# EAGLE design ARE_adaptadora_PIC_18-20pin (EAGLE 6.5.0)
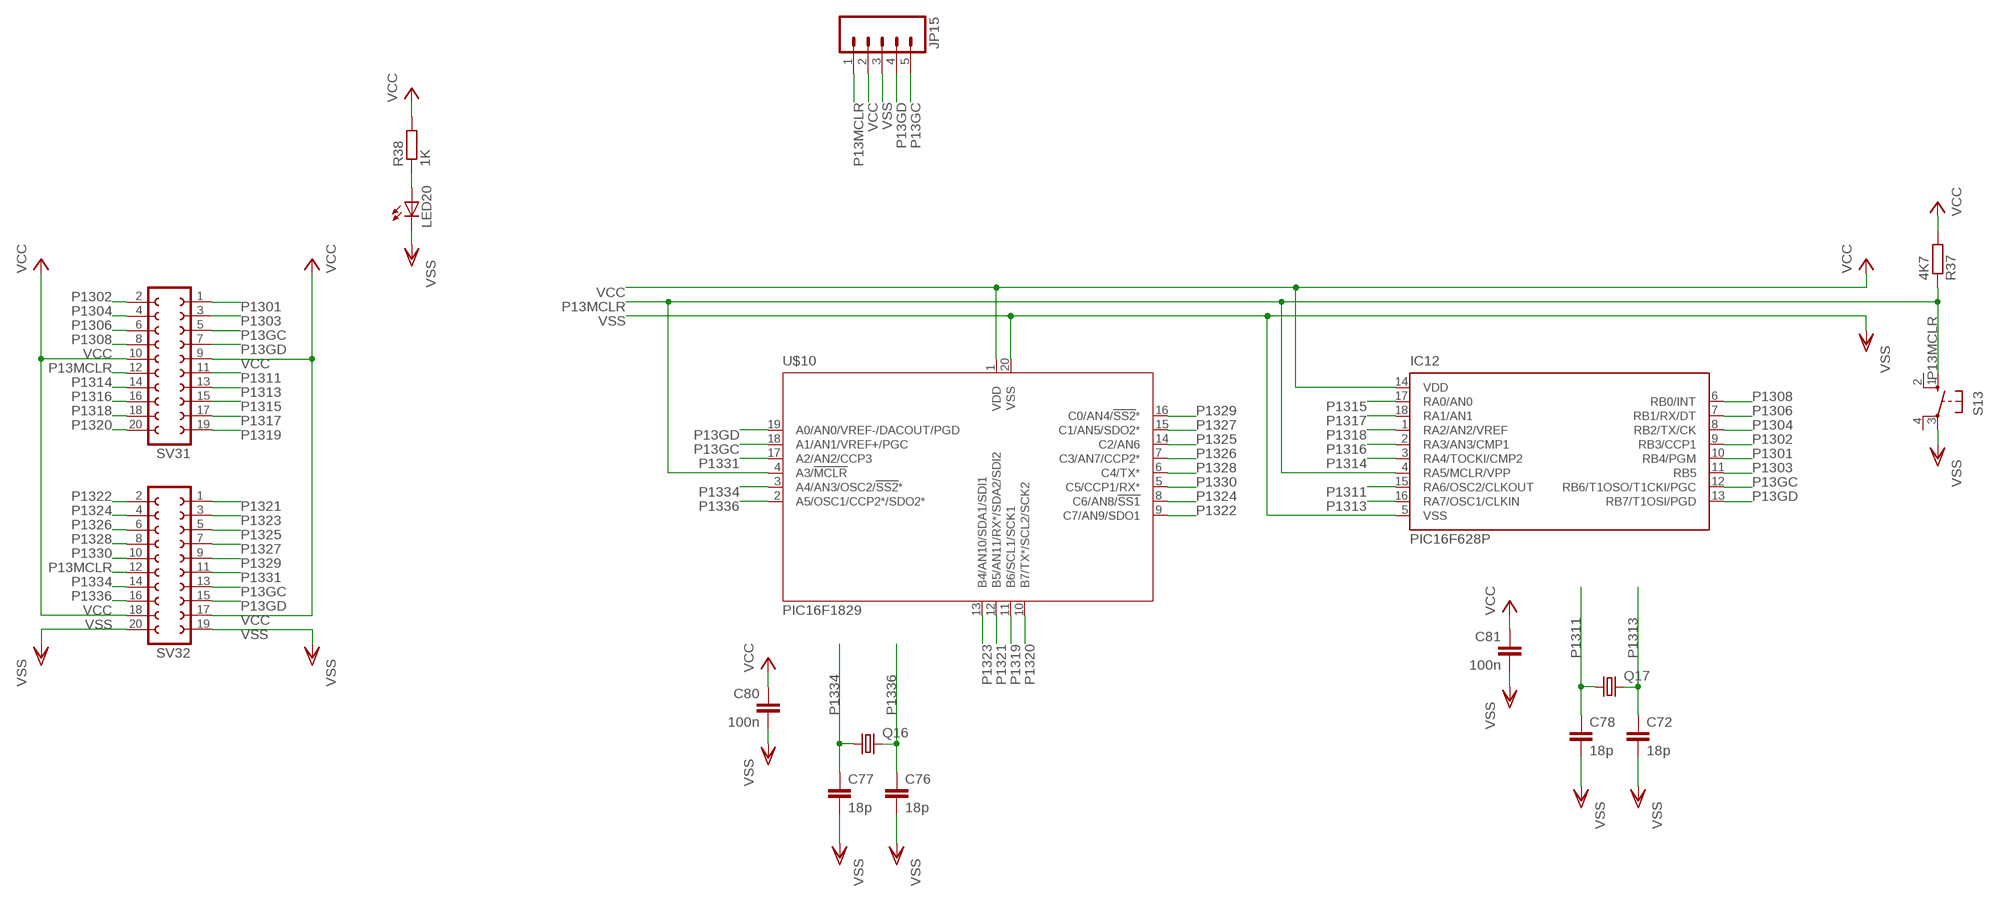
[diagram p0: schematic, sheet 1]

## Parts
C72  18p  C-EUC0805  [C0805]
C76  18p  C-EUC0805  [C0805]
C77  18p  C-EUC0805  [C0805]
C78  18p  C-EUC0805  [C0805]
C80  100n  C-EUC0805  [C0805]
C81  100n  C-EUC0805  [C0805]
IC12  PIC16F628P  [DIL18]
JP15  M05PTH  [1X05]
LED20  LEDCHIPLED_0805  [CHIPLED_0805]
Q16  CRYSTALHC18U-V  [HC18U-V]
Q17  CRYSTALHC18U-V  [HC18U-V]
R37  4K7  R-EU_R0805  [R0805]
R38  1K  R-EU_R0805  [R0805]
S13  10-XX  [B3F-10XX]
SV31  FE10-2W  [FE10-2W]
SV32  FE10-2W  [FE10-2W]
U$10  PIC16F1829  [DIL20]

## Nets
N$81: LED20.A R38.1
P13GC: IC12.12(RB6/T1OSO/T1CKI/PGC) JP15.5 SV31.5 SV32.13 U$10.18(A1/AN1/VREF+/PGC)
P13GD: IC12.13(RB7/T1OSI/PGD) JP15.4 SV31.7 SV32.15 U$10.19(A0/AN0/VREF-/DACOUT/PGD)
P13MCLR: IC12.4(RA5/MCLR/VPP) JP15.1 R37.1 S13.1(S) SV31.12 SV32.12 U$10.4(A3/!MCLR)
P1301: IC12.10(RB4/PGM) SV31.1
P1302: IC12.9(RB3/CCP1) SV31.2
P1303: IC12.11(RB5) SV31.3
P1304: IC12.8(RB2/TX/CK) SV31.4
P1306: IC12.7(RB1/RX/DT) SV31.6
P1308: IC12.6(RB0/INT) SV31.8
P1311: C78.1 IC12.15(RA6/OSC2/CLKOUT) Q17.1 SV31.11
P1313: C72.1 IC12.16(RA7/OSC1/CLKIN) Q17.2 SV31.13
P1314: IC12.3(RA4/TOCKI/CMP2) SV31.14
P1315: IC12.17(RA0/AN0) SV31.15
P1316: IC12.2(RA3/AN3/CMP1) SV31.16
P1317: IC12.18(RA1/AN1) SV31.17
P1318: IC12.1(RA2/AN2/VREF) SV31.18
P1319: SV31.19 U$10.11(B6/SCL1/SCK1)
P1320: SV31.20 U$10.10(B7/TX*/SCL2/SCK2)
P1321: SV32.1 U$10.12(B5/AN11/RX*/SDA2/SDI2)
P1322: SV32.2 U$10.9(C7/AN9/SDO1)
P1323: SV32.3 U$10.13(B4/AN10/SDA1/SDI1)
P1324: SV32.4 U$10.8(C6/AN8/!SS1)
P1325: SV32.5 U$10.14(C2/AN6)
P1326: SV32.6 U$10.7(C3/AN7/CCP2*)
P1327: SV32.7 U$10.15(C1/AN5/SDO2*)
P1328: SV32.8 U$10.6(C4/TX*)
P1329: SV32.9 U$10.16(C0/AN4/!SS2!*)
P1330: SV32.10 U$10.5(C5/CCP1/RX*)
P1331: SV32.11 U$10.17(A2/AN2/CCP3)
P1334: C77.1 Q16.1 SV32.14 U$10.3(A4/AN3/OSC2/!SS2!*)
P1336: C76.1 Q16.2 SV32.16 U$10.2(A5/OSC1/CCP2*/SDO2*)
VCC: C80.1 C81.1 IC12.14(VDD) JP15.2 R37.2 R38.2 SV31.9 SV31.10 SV32.17 SV32.18 U$10.1(VDD)
VSS: C72.2 C76.2 C77.2 C78.2 C80.2 C81.2 IC12.5(VSS) JP15.3 LED20.C S13.3(P) SV32.19 SV32.20 U$10.20(VSS)
Unconnected: S13.2(S1) S13.4(P1)

## Library data of the parts
C72 C76-C78 C80 C81 = rcl:C-EU: CAPACITOR, European symbol
IC12 = microchip:PIC16F62*: FLASH-Based 8-Bit CMOS Microcontroller Source: http://ww1.microchip.com/downloads/en/DeviceDoc/40300C.pdf; MF: MICROCHIP; MPN: PIC16F628-04I/P; OC_FARNELL: 9760407; OC_NEWARK: 19C7272
JP15 = SparkFun:M05: Header 5 Standard 5-pin 0.1" header. Use with straight break away headers (SKU : PRT-00116), right angle break away headers (PRT-00553), swiss pins (PRT-00743), machine pins (PRT-00117), and female headers (PRT-00115). Molex polarized connector foot print use with SKU : PRT-08230 with associated crimp pins and housings.
LED20 = led:LED: LED OSRAM: - CHIPLED LG R971, LG N971, LY N971, LG Q971, LY Q971, LO R971, LY R971 LH N974, LH R974 LS Q976, LO Q976, LY Q976 LO Q996 - Hyper CHIPLED LW Q18S LB Q993, LB Q99A, LB R99A - SideLED LS A670, LO A670, LY A670, LG A670, LP A670 LB A673, LV A673, LT A673, LW A673 LH A674 LY A675 LS A676, LA A676, LO A676, LY A676, LW A676 LS A679, LY A679, LG A679 - Hyper Micro SIDELED® LS Y876, LA Y876, LO Y876, LY Y876 LT Y87S - SmartLED LW L88C, LW L88S LB L89C, LB L89S, LG L890 LS L89K, LO L89K, LY L89K LS L896, LA L896, LO L896, LY L896 - TOPLED LS T670, LO T670, LY T670, LG T670, LP T670 LSG T670, LSP T670, LSY T670, LOP T670, LYG T670 LG T671, LOG T671, LSG T671 LB T673, LV T673, LT T673, LW T673 LH T674 LS T676, LA T676, LO T676, LY T676, LB T676, LH T676, LSB T676, LW T676 LB T67C, LV T67C, LT T67C, LS T67K, LO T67K, LY T67K, LW E67C LS E67B, LA E67B, LO E67B, LY E67B, LB E67C, LV E67C, LT E67C LW T67C LS T679, LY T679, LG T679 LS T770, LO T770, LY T770, LG T770, LP T770 LB T773, LV T773, LT T773, LW T773 LH T774 LS E675, LA E675, LY E675, LS T675 LS T776, LA T776, LO T776, LY T776, LB T776 LHGB T686 LT T68C, LB T68C - Hyper Mini TOPLED® LB M676 - Mini TOPLED Santana® LG M470 LS M47K, LO M47K, LY M47K Source: http://www.osram.convergy.de LUXEON: - LUMILED® LXK2-PW12-R00, LXK2-PW12-S00, LXK2-PW14-U00, LXK2-PW14-V00 LXK2-PM12-R00, LXK2-PM12-S00, LXK2-PM14-U00 LXK2-PE12-Q00, LXK2-PE12-R00, LXK2-PE12-S00, LXK2-PE14-T00, LXK2-PE14-U00 LXK2-PB12-K00, LXK2-PB12-L00, LXK2-PB12-M00, LXK2-PB14-N00, LXK2-PB14-P00, LXK2-PB14-Q00 LXK2-PR12-L00, LXK2-PR12-M00, LXK2-PR14-Q00, LXK2-PR14-R00 LXK2-PD12-Q00, LXK2-PD12-R00, LXK2-PD12-S00 LXK2-PH12-R00, LXK2-PH12-S00 LXK2-PL12-P00, LXK2-PL12-Q00, LXK2-PL12-R00 Source: www.luxeon.com KINGBRIGHT: KA-3528ASYC Source: www.kingbright.com
Q16 Q17 = crystal:CRYSTAL: CRYSTAL; OC_FARNELL: unknown; OC_NEWARK: unknown
R37 R38 = rcl:R-EU_: RESISTOR, European symbol
S13 = switch-omron:10-XX: OMRON SWITCH; MPN: B3F-1000; OC_FARNELL: 176432; OC_NEWARK: 36M3542
SV31 SV32 = con-lsta:FE10-2W: FEMALE HEADER; OC_FARNELL: unknown; OC_NEWARK: unknown
U$10 = microchip:PIC16F1829

## Board
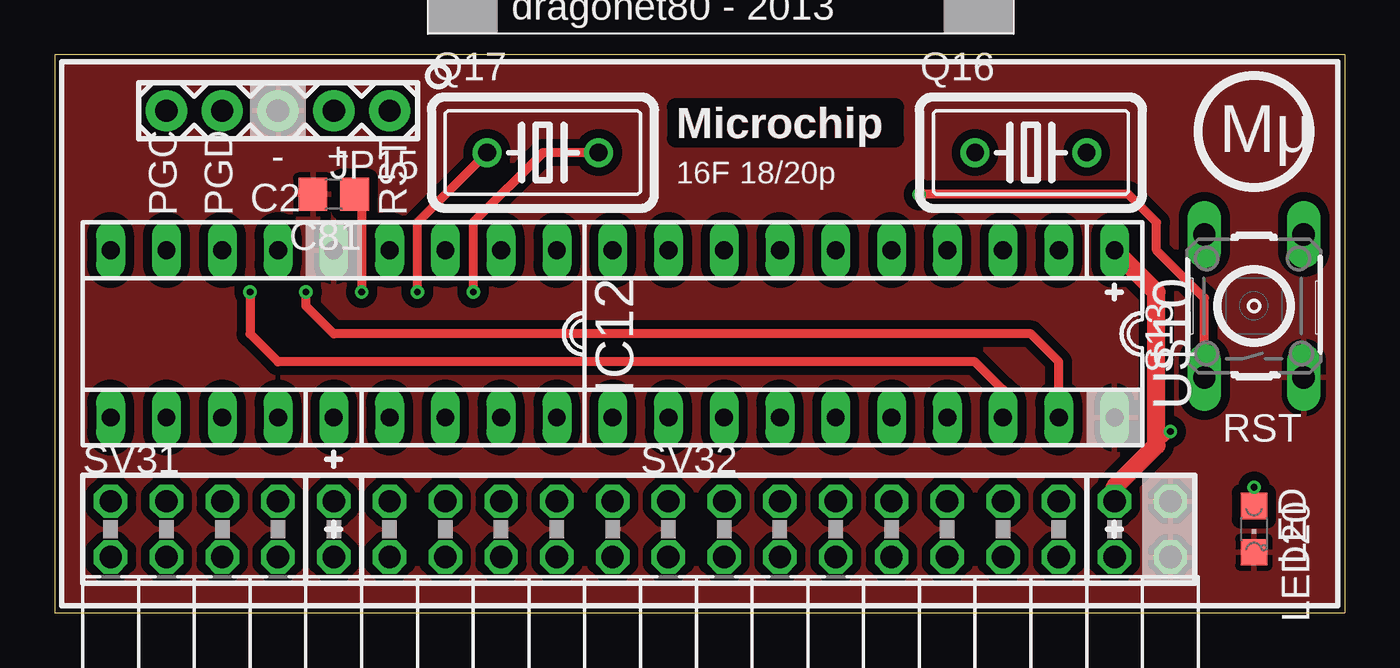
[diagram p1: board, top side]
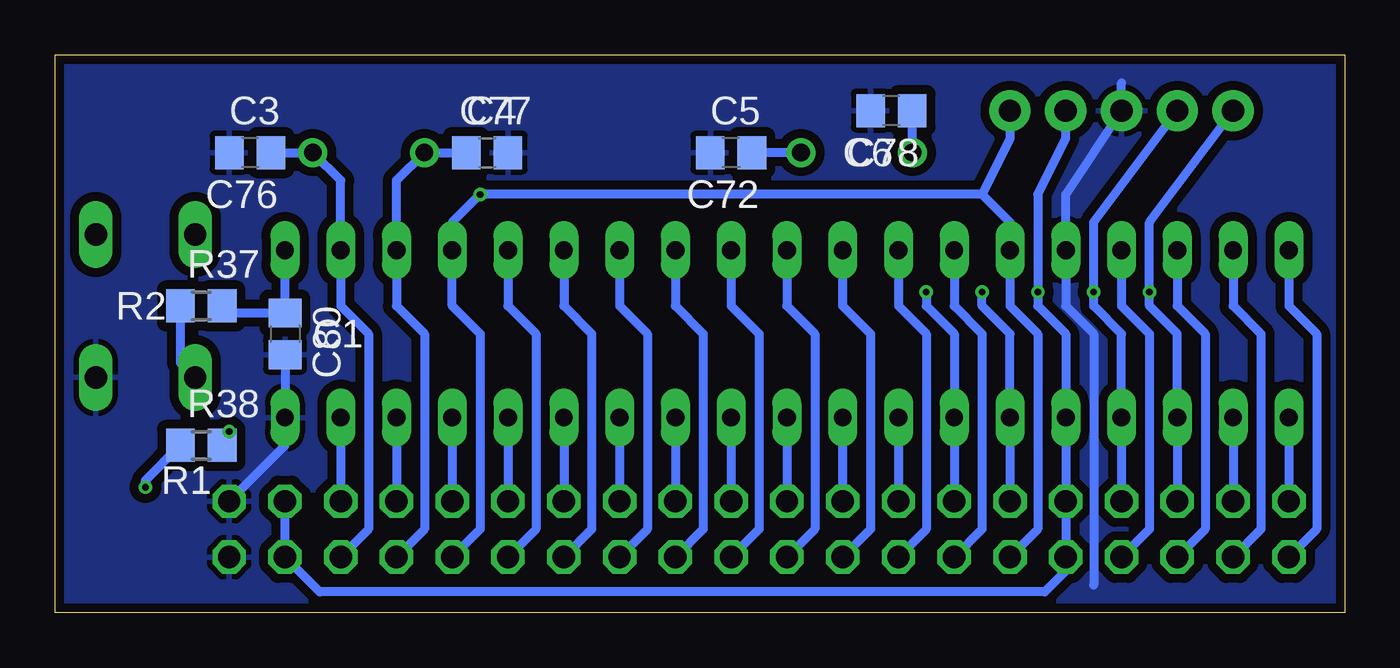
[diagram p2: board, bottom side, seen from below]

Size 58.74 x 25.4 mm. Coordinates in mm from the lower left corner, seen from the top.
Outline: 0,0 58.74,0 58.74,25.4 0,25.4 0,0
Copper layers (1*16): Top 0.035mm / dielectric 1.5mm / Bottom 0.035mm
Design rules "ITEADstudio_DRC": minimum track width 6mil, minimum drill 12mil, track to track 6mil, track to pad 6mil, pad to pad 6mil, via to via 6mil, smd to smd 0mil, copper to edge 10mil, drill to drill 10mil, minimum pad ring 10mil, minimum via ring 6mil, stop-mask expansion 2mil, vias tented up to drill 100mil, thermal gap 10mil

### Footprints (pad centres in the part's own frame; a part is rotated, then mirrored left to right if it is on the bottom)
C0805 = smd 1.3 x 1.5: 1 -0.95,0; 2 0.95,0
DIL18 = drill 0.813 long: 1 -10.16,-3.81; 2 -7.62,-3.81; 3 -5.08,-3.81; 4 -2.54,-3.81; 5 0,-3.81; 6 2.54,-3.81; 7 5.08,-3.81; 8 7.62,-3.81; 9 10.16,-3.81; 10 10.16,3.81; 11 7.62,3.81; 12 5.08,3.81; 13 2.54,3.81; 14 0,3.81; 15 -2.54,3.81; 16 -5.08,3.81; 17 -7.62,3.81; 18 -10.16,3.81
1X05 = drill 1.016 pad 1.88: 1 0,0; 2 2.54,0; 3 5.08,0; 4 7.62,0; 5 10.16,0
CHIPLED_0805 = smd 1.2 x 1.2: A 0,-1.05; C 0,1.05
HC18U-V = drill 0.813: 1 -2.54,0; 2 2.54,0
R0805 = smd 1.3 x 1.5: 1 -0.95,0; 2 0.95,0
B3F-10XX = drill 1.016 long: 1 -3.251,2.261; 2 3.251,2.261; 3 -3.251,-2.261; 4 3.251,-2.261
FE10-2W = drill 1.016 octagon: 1 -11.43,1.27; 2 -11.43,-1.27; 3 -8.89,1.27; 4 -8.89,-1.27; 5 -6.35,1.27; 6 -6.35,-1.27; 7 -3.81,1.27; 8 -3.81,-1.27; 9 -1.27,1.27; 10 -1.27,-1.27; 11 1.27,1.27; 12 1.27,-1.27; 13 3.81,1.27; 14 3.81,-1.27; 15 6.35,1.27; 16 6.35,-1.27; 17 8.89,1.27; 18 8.89,-1.27; 19 11.43,1.27; 20 11.43,-1.27
DIL20 = drill 0.813 long: 1 -10.16,-3.81; 2 -7.62,-3.81; 3 -5.08,-3.81; 4 -2.54,-3.81; 5 0,-3.81; 6 2.54,-3.81; 7 5.08,-3.81; 8 7.62,-3.81; 9 10.16,-3.81; 10 12.7,-3.81; 11 12.7,3.81; 12 10.16,3.81; 13 7.62,3.81; 14 5.08,3.81; 15 2.54,3.81; 16 0,3.81; 17 -2.54,3.81; 18 -5.08,3.81; 19 -7.62,3.81; 20 -10.16,3.81

### Placement (x,y rotation side)
C72  27.94,20.95 180 bottom
C76  49.85,20.95 180 bottom
C77  39.05,20.95 0 bottom
C78  20.64,22.86 180 bottom
C80  48.26,12.7 270 bottom
C81  12.7,19.05 180 top
IC12  12.7,12.7 180 top
JP15  15.24,22.86 180 top
LED20  54.61,3.81 180 top
Q16  44.45,20.95 0 top
Q17  22.23,20.95 0 top
R37  52.07,13.97 0 bottom
R38  52.07,7.62 0 bottom
S13  54.61,13.97 90 top
SV31  13.97,3.81 0 top
SV32  39.37,3.81 0 top
U$10  38.1,12.7 180 top

### Tracks (layer width: path | path; a pad name or v marks a point on that pad's centre or on a via)
N$81  (via drill 0.3)
  Top 0.406: v54.61,5.71 LED20.A
  Bottom 0.406: R38.1 54.61,6.03 v54.61,5.71
P13GC  (via drill 0.3)
  Top 0.406: U$10.18 43.18,10.16 41.91,11.43 10.16,11.43 8.89,12.7 v8.89,14.61
  Bottom 0.406: U$10.18 SV32.13 | SV31.5 IC12.12 7.62,12.7 8.89,13.97 v8.89,14.61 8.89,17.78 JP15.5
P13GD  (via drill 0.3)
  Top 0.406: U$10.19 45.72,11.43 44.45,12.7 12.7,12.7 11.43,13.97 v11.43,14.61
  Bottom 0.406: U$10.19 SV32.15 | SV31.7 IC12.13 10.16,12.7 11.43,13.97 v11.43,14.61 11.43,17.78 JP15.4
P13MCLR  (via drill 0.3)
  Top 0.406: S13.1 52.35,14.33 50.17,16.51 50.17,17.78 48.89,19.05 v39.37,19.05
  Bottom 0.406: SV31.12 13.97,3.81 13.97,12.7 15.24,13.97 IC12.4 15.24,17.78 16.51,19.05 | SV32.12 39.37,3.81 39.37,12.7 40.64,13.97 U$10.4 40.64,17.78 v39.37,19.05 16.51,19.05 | JP15.1 15.24,21.59 16.51,19.05 | R37.1 53.02,11.39 S13.1
P1301
  Bottom 0.406: IC12.10 SV31.1
P1302
  Bottom 0.406: IC12.9 2.54,13.97 1.27,12.7 1.27,3.81 SV31.2
P1303
  Bottom 0.406: IC12.11 SV31.3
P1304
  Bottom 0.406: IC12.8 5.08,13.97 3.81,12.7 3.81,3.81 SV31.4
P1306
  Bottom 0.406: IC12.7 7.62,13.97 6.35,12.7 6.35,3.81 SV31.6
P1308
  Bottom 0.406: IC12.6 10.16,13.97 8.89,12.7 8.89,3.81 SV31.8
P1311  (via drill 0.3)
  Top 0.406: v16.51,14.61 16.51,17.78 Q17.1
  Bottom 0.406: SV31.11 IC12.15 15.24,12.7 16.51,13.97 v16.51,14.61 | Q17.1 C78.1
P1313  (via drill 0.3)
  Top 0.406: Q17.2 22.23,20.95 19.05,17.78 v19.05,14.61
  Bottom 0.406: SV31.13 IC12.16 17.78,12.7 19.05,13.97 v19.05,14.61 | Q17.2 C72.1
P1314
  Bottom 0.406: IC12.3 17.78,13.97 16.51,12.7 16.51,3.81 SV31.14
P1315
  Bottom 0.406: IC12.17 SV31.15
P1316
  Bottom 0.406: IC12.2 20.32,13.97 19.05,12.7 19.05,3.81 SV31.16
P1317
  Bottom 0.406: IC12.18 SV31.17
P1318
  Bottom 0.406: IC12.1 22.86,13.97 21.59,12.7 21.59,3.81 SV31.18
P1319
  Bottom 0.406: U$10.11 SV31.19
P1320
  Bottom 0.406: U$10.10 25.4,13.97 24.13,12.7 24.13,3.81 SV31.20
P1321
  Bottom 0.406: U$10.12 SV32.1
P1322
  Bottom 0.406: U$10.9 27.94,13.97 26.67,12.7 26.67,3.81 SV32.2
P1323
  Bottom 0.406: U$10.13 SV32.3
P1324
  Bottom 0.406: U$10.8 30.48,13.97 29.21,12.7 29.21,3.81 SV32.4
P1325
  Bottom 0.406: U$10.14 SV32.5
P1326
  Bottom 0.406: U$10.7 33.02,13.97 31.75,12.7 31.75,3.81 SV32.6
P1327
  Bottom 0.406: U$10.15 SV32.7
P1328
  Bottom 0.406: U$10.6 35.56,13.97 34.29,12.7 34.29,3.81 SV32.8
P1329
  Bottom 0.406: U$10.16 SV32.9
P1330
  Bottom 0.406: U$10.5 38.1,13.97 36.83,12.7 36.83,3.81 SV32.10
P1331
  Bottom 0.406: U$10.17 SV32.11
P1334
  Bottom 0.406: SV32.14 41.91,3.81 41.91,12.7 43.18,13.97 U$10.3 43.18,19.69 Q16.1 C77.1
P1336
  Bottom 0.406: SV32.16 44.45,3.81 44.45,12.7 45.72,13.97 U$10.2 45.72,19.69 Q16.2 C76.1
VCC  (via drill 0.3)
  Top 0.406: C81.1 13.34,19.05 13.97,18.41 v13.97,14.61 | v50.8,8.26 50.17,7.62
  Top 0.813: SV32.17 48.26,5.71 50.17,7.62 50.17,14.61 U$10.1
  Bottom 0.406: SV32.17 SV32.18 46.67,0.95 13.65,0.95 12.7,1.91 SV31.10 SV31.9 IC12.14 12.7,12.7 13.97,13.97 v13.97,14.61 13.97,19.05 12.7,21.59 JP15.2 | U$10.1 C80.1 50.8,13.65 R37.2 | R38.2 51.12,7.94 v50.8,8.26
VSS
  Bottom 0.406: C80.2 U$10.20 48.26,7.62 SV32.19 | 11.43,1.27 11.43,12.7 12.7,13.97 IC12.5 12.7,19.05 JP15.3 10.16,24.13
  pour Bottom (isolate 0.406): 0,0 58.74,0 58.74,25.4 0,25.4
  pour Top (isolate 0.406): 0,0 58.74,0 58.74,25.4 0,25.4

### Text on the board
Top: Microchip
_tsilk: CC by nc sa | dragonet80 - 2013 | Microchip | - | + | Mµ | 16F 18/20p | C2 | PGC | PGD | RST | RST | LED
_bsilk: C5 | C4 | C3 | C6 | R2 | C1 | R1